# EAGLE schematic wemos_envir (EAGLE 8.1.1)
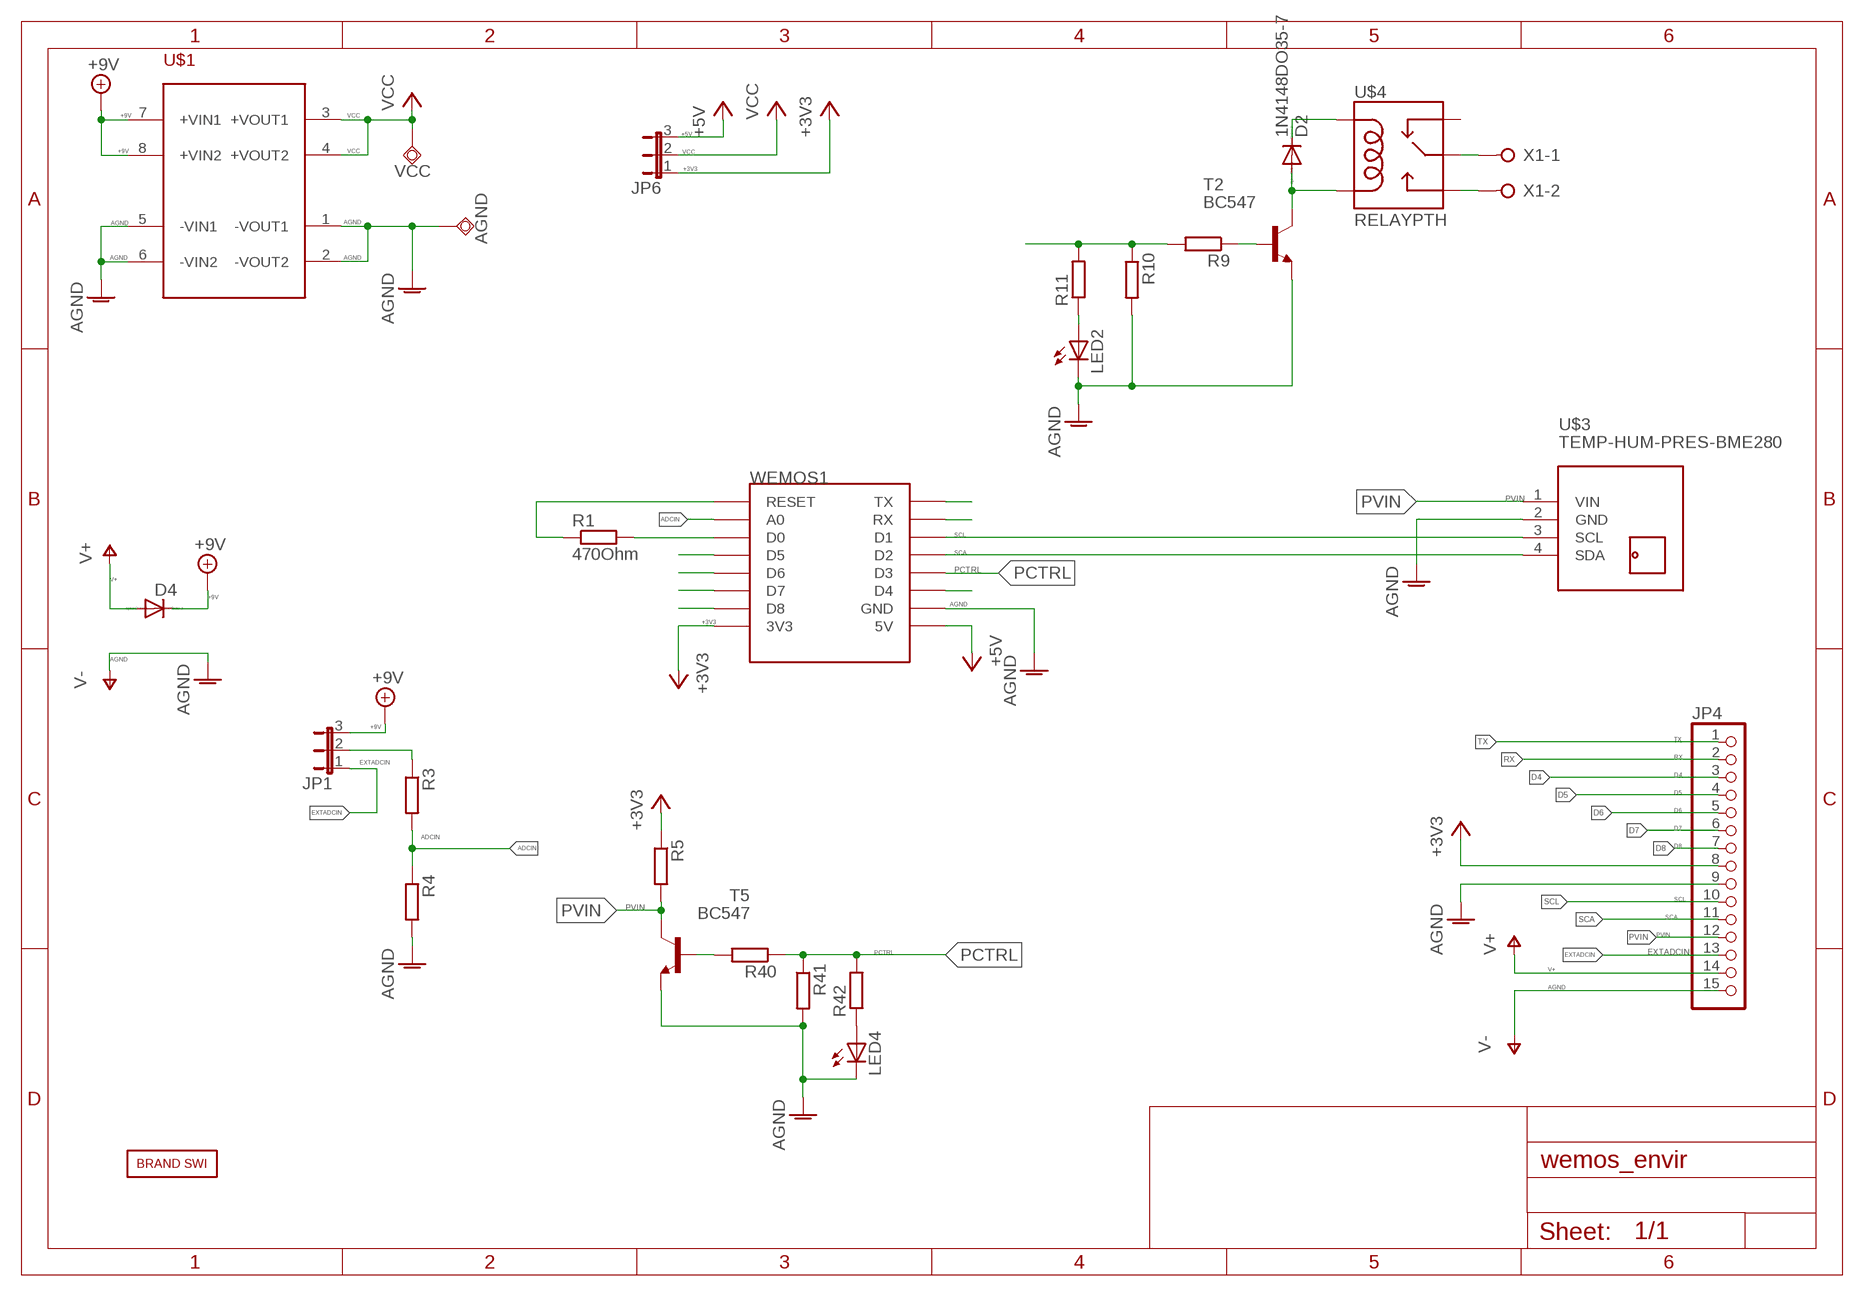
[diagram p0: schematic, sheet 1]

## Parts
AGND  TPSQTP20SQ  [TP20SQ]
D2  1N4148DO35-7  [DO35-7]
D4  1N4148DO35-7  [DO35-7]
JP1  JP2E  [JP2]
JP4  PINHD-1X15  [1X15]
JP6  JP2E  [JP2]
LED2  LEDCHIP-LED0805  [CHIP-LED0805]
LED4  LEDCHIP-LED0805  [CHIP-LED0805]
R1  470Ohm  R-EU_R0805  [R0805]
R3  R-EU_R0805  [R0805]
R4  R-EU_R0805  [R0805]
R5  R-EU_R0805  [R0805]
R9  R-EU_R0805  [R0805]
R10  R-EU_R0805  [R0805]
R11  R-EU_R0805  [R0805]
R40  R-EU_R0805  [R0805]
R41  R-EU_R0805  [R0805]
R42  R-EU_R0805  [R0805]
T2  BC547  [TO92]
T5  BC547  [TO92]
U$1  LVPS  [LVPS]
U$2  BRAND_SWI5X7  [BRAND_SWI_5X7]
U$3  TEMP-HUM-PRES-BME280  [TEMP-HUM-PRES-BME280]
U$4  RELAYPTH  [SRD-05VDC-SL-C]
VCC  TPSQTP20SQ  [TP20SQ]
WEMOS1  WEMOS-D1-MINI  [WEMOS-D1-MINI]
X1  W237-02P  [W237-132]

## Nets
+3V3: JP4.8 JP6.1 R5.1
+5V: JP6.3
+9V: D4.C JP1.3 U$1.7(+VIN1) U$1.8(+VIN2)
ADCIN: R3.2 R4.1 WEMOS1.A0
AGND: AGND.TP JP4.9 JP4.15 LED2.C LED4.C R4.2 R10.2 R41.2 T2.1(E) T5.1(E) U$1.2(-VOUT2) U$1.5(-VIN1) U$1.6(-VIN2) U$3.2(GND) ; supply symbol labelled V-
D4: JP4.3 WEMOS1.D4
D5: JP4.4 WEMOS1.D5
D6: JP4.5 WEMOS1.D6
D7: JP4.6 WEMOS1.D7
D8: JP4.7 WEMOS1.D8
EXTADCIN: JP1.1 JP4.13
N$1: JP1.2 R3.1
N$2: R1.2 WEMOS1.D0
N$3: D2.C U$4.COIL1
N$4: D2.A T2.3(C) U$4.COIL0
N$5: R9.1 T2.2(B)
N$6: R9.2 R10.1 R11.2
N$7: LED2.A R11.1
N$8: U$4.SWOPEN X1.2
N$9: U$4.SWCOMMON X1.1
N$10: R1.1 WEMOS1.RESET
N$27: R40.2 T5.2(B)
N$31: LED4.A R42.1
PCTRL: R40.1 R41.1 R42.2 WEMOS1.D3
PVIN: JP4.12 R5.2 T5.3(C) U$3.1(VIN)
RX: JP4.2 WEMOS1.RX
SCA: JP4.11 U$3.4(SDA) WEMOS1.D2
SCL: JP4.10 U$3.3(SCL) WEMOS1.D1
TX: JP4.1 WEMOS1.TX
V+: D4.A JP4.14
VCC: JP6.2 U$1.3(+VOUT1) U$1.4(+VOUT2) VCC.TP
Unconnected: U$1.1(-VOUT1) U$4.SWCLOSED(SWCLOSE) WEMOS1.3V3 WEMOS1.5V WEMOS1.GND

## Library data of the parts
AGND VCC = testpad:TPSQ: Test pad
D2 D4 = diode:1N4148: DIODE high speed (Philips)
JP1 JP6 = jumper:JP2E: JUMPER
JP4 = pinhead:PINHD-1X15: PIN HEADER
LED2 LED4 = led:LED: LED OSRAM: - CHIPLED LG R971, LG N971, LY N971, LG Q971, LY Q971, LO R971, LY R971 LH N974, LH R974 LS Q976, LO Q976, LY Q976 LO Q996 - Hyper CHIPLED LW Q18S LB Q993, LB Q99A, LB R99A - SideLED LS A670, LO A670, LY A670, LG A670, LP A670 LB A673, LV A673, LT A673, LW A673 LH A674 LY A675 LS A676, LA A676, LO A676, LY A676, LW A676 LS A679, LY A679, LG A679 - Hyper Micro SIDELED® LS Y876, LA Y876, LO Y876, LY Y876 LT Y87S - SmartLED LW L88C, LW L88S LB L89C, LB L89S, LG L890 LS L89K, LO L89K, LY L89K LS L896, LA L896, LO L896, LY L896 - TOPLED LS T670, LO T670, LY T670, LG T670, LP T670 LSG T670, LSP T670, LSY T670, LOP T670, LYG T670 LG T671, LOG T671, LSG T671 LB T673, LV T673, LT T673, LW T673 LH T674 LS T676, LA T676, LO T676, LY T676, LB T676, LH T676, LSB T676, LW T676 LB T67C, LV T67C, LT T67C, LS T67K, LO T67K, LY T67K, LW E67C LS E67B, LA E67B, LO E67B, LY E67B, LB E67C, LV E67C, LT E67C LW T67C LS T679, LY T679, LG T679 LS T770, LO T770, LY T770, LG T770, LP T770 LB T773, LV T773, LT T773, LW T773 LH T774 LS E675, LA E675, LY E675, LS T675 LS T776, LA T776, LO T776, LY T776, LB T776 LHGB T686 LT T68C, LB T68C - Hyper Mini TOPLED® LB M676 - Mini TOPLED Santana® LG M470 LS M47K, LO M47K, LY M47K Source: http://www.osram.convergy.de LUXEON: - LUMILED® LXK2-PW12-R00, LXK2-PW12-S00, LXK2-PW14-U00, LXK2-PW14-V00 LXK2-PM12-R00, LXK2-PM12-S00, LXK2-PM14-U00 LXK2-PE12-Q00, LXK2-PE12-R00, LXK2-PE12-S00, LXK2-PE14-T00, LXK2-PE14-U00 LXK2-PB12-K00, LXK2-PB12-L00, LXK2-PB12-M00, LXK2-PB14-N00, LXK2-PB14-P00, LXK2-PB14-Q00 LXK2-PR12-L00, LXK2-PR12-M00, LXK2-PR14-Q00, LXK2-PR14-R00 LXK2-PD12-Q00, LXK2-PD12-R00, LXK2-PD12-S00 LXK2-PH12-R00, LXK2-PH12-S00 LXK2-PL12-P00, LXK2-PL12-Q00, LXK2-PL12-R00 Source: www.luxeon.com KINGBRIGHT: KA-3528ASYC Source: www.kingbright.com
R1 R3-R5 R9-R11 R40-R42 = rcl:R-EU_: RESISTOR, European symbol
T2 T5 = transistor:BC547: NPN TRANSISTOR
U$1 = SWI_COMMONS:LVPS: Low Voltage Power Supply
U$2 = BRAND_SWI:BRAND_SWI
U$3 = diy-modules:TEMP-HUM-PRES-BME280: Digital Humidity-Temperature-Pressure Sensor based on BME280 device More information about BME280 device is available here: https://www.bosch-sensortec.com/bst/products/all_products/bme280 Click here to find device on ebay.com <http://www.ebay.com/sch/bme280+breakout>
U$4 = SWI_COMMONS:RELAY: SPDT relay (COM-00101)
WEMOS1 = SWI_COMMONS:WEMOS-D1-MINI: WeMos.cc D1 mini ESP8266 module
X1 = con-wago-508:W237-02P: WAGO SREW CLAMP; OC_FARNELL: unknown; OC_NEWARK: unknown